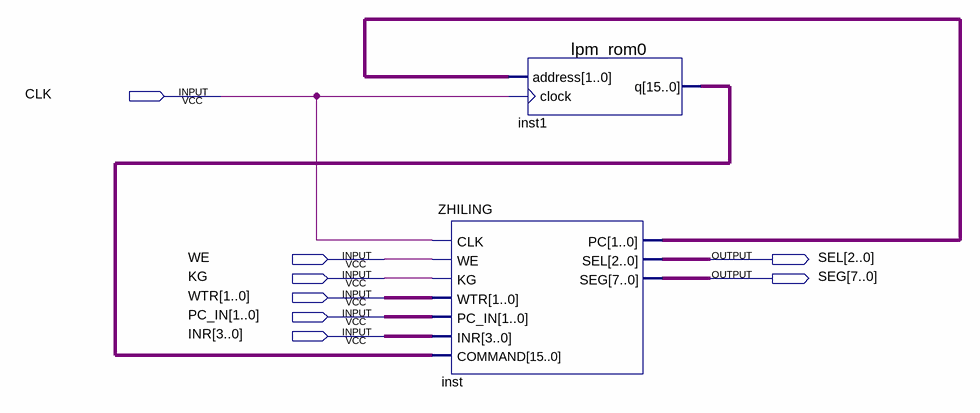
[diagram p0: schematic sheet]
// Quartus schematic gjhjh.bdf as structural Verilog: 2 symbols, 8 pins
module gjhjh (
  input  CLK,
  input  WE,
  input  KG,
  input  [1:0] WTR,
  input  [1:0] PC_IN,
  input  [3:0] INR,
  output [2:0] SEL,
  output [7:0] SEG
);

  wire [1:0] inst_pc;
  wire [15:0] inst1_q;

  ZHILING inst (
    .CLK(CLK), .WE(WE), .KG(KG), .WTR(WTR), .PC_IN(PC_IN), .INR(INR), .COMMAND(inst1_q), .PC(inst_pc),
    .SEL(SEL), .SEG(SEG));
  lpm_rom0 inst1 (.address(inst_pc), .clock(CLK), .q(inst1_q));
endmodule
